# EAGLE board board (EAGLE 6.4)
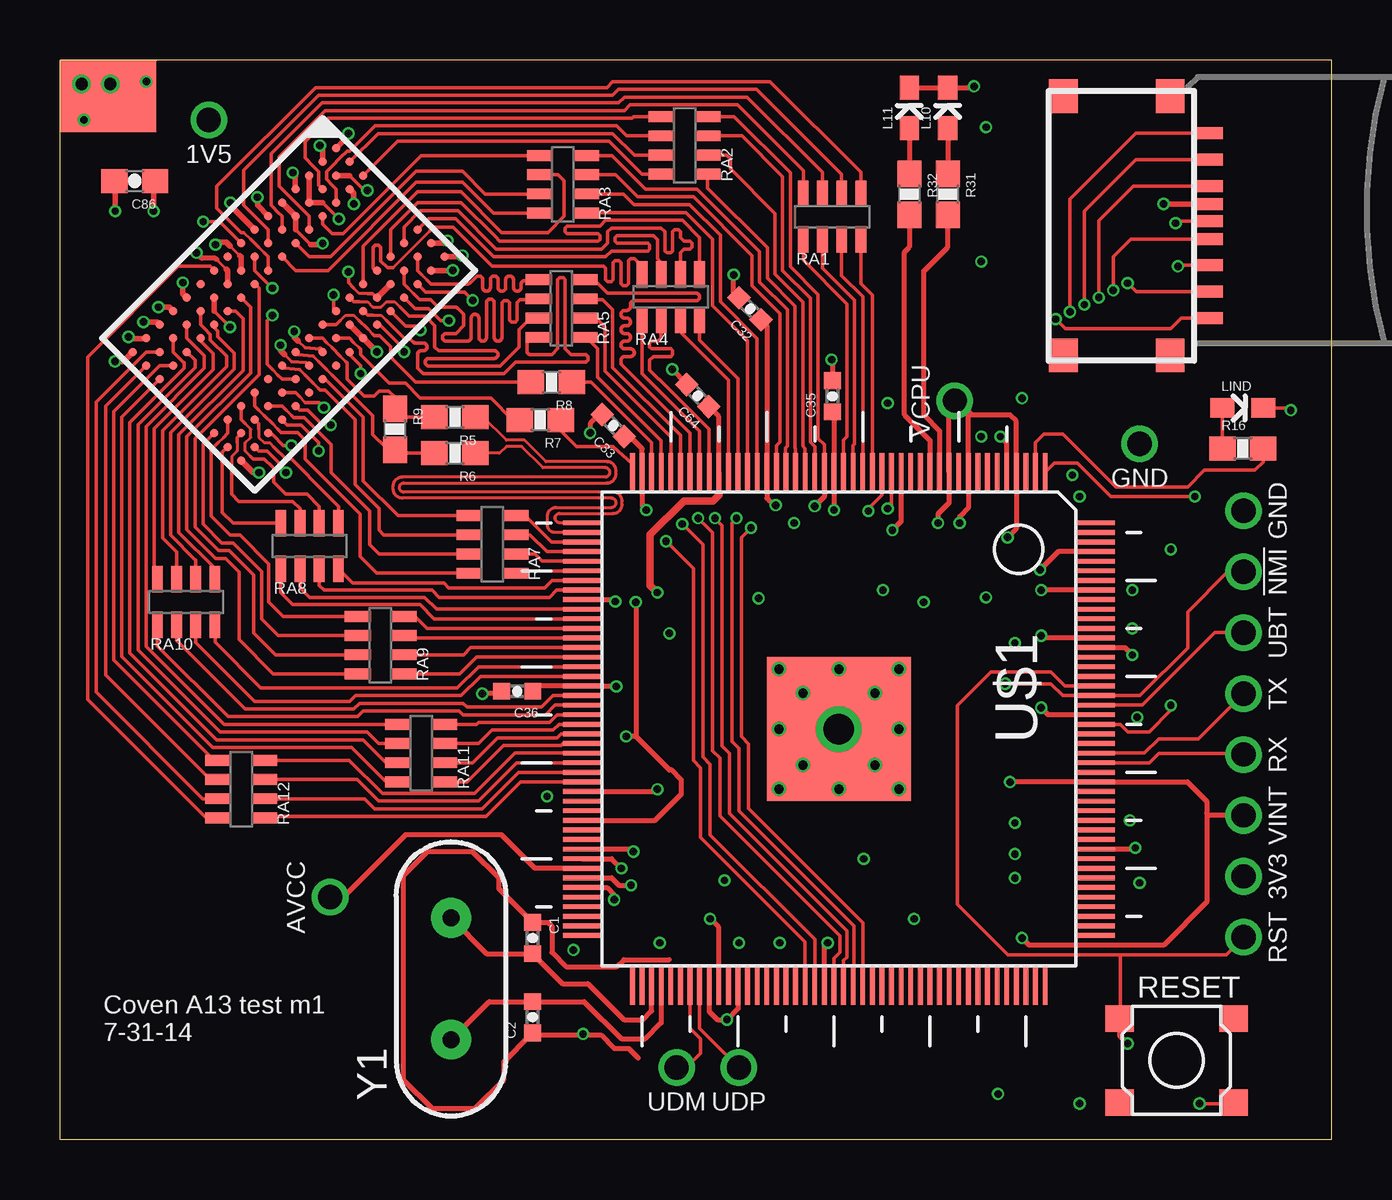
[diagram p2: board, top side]
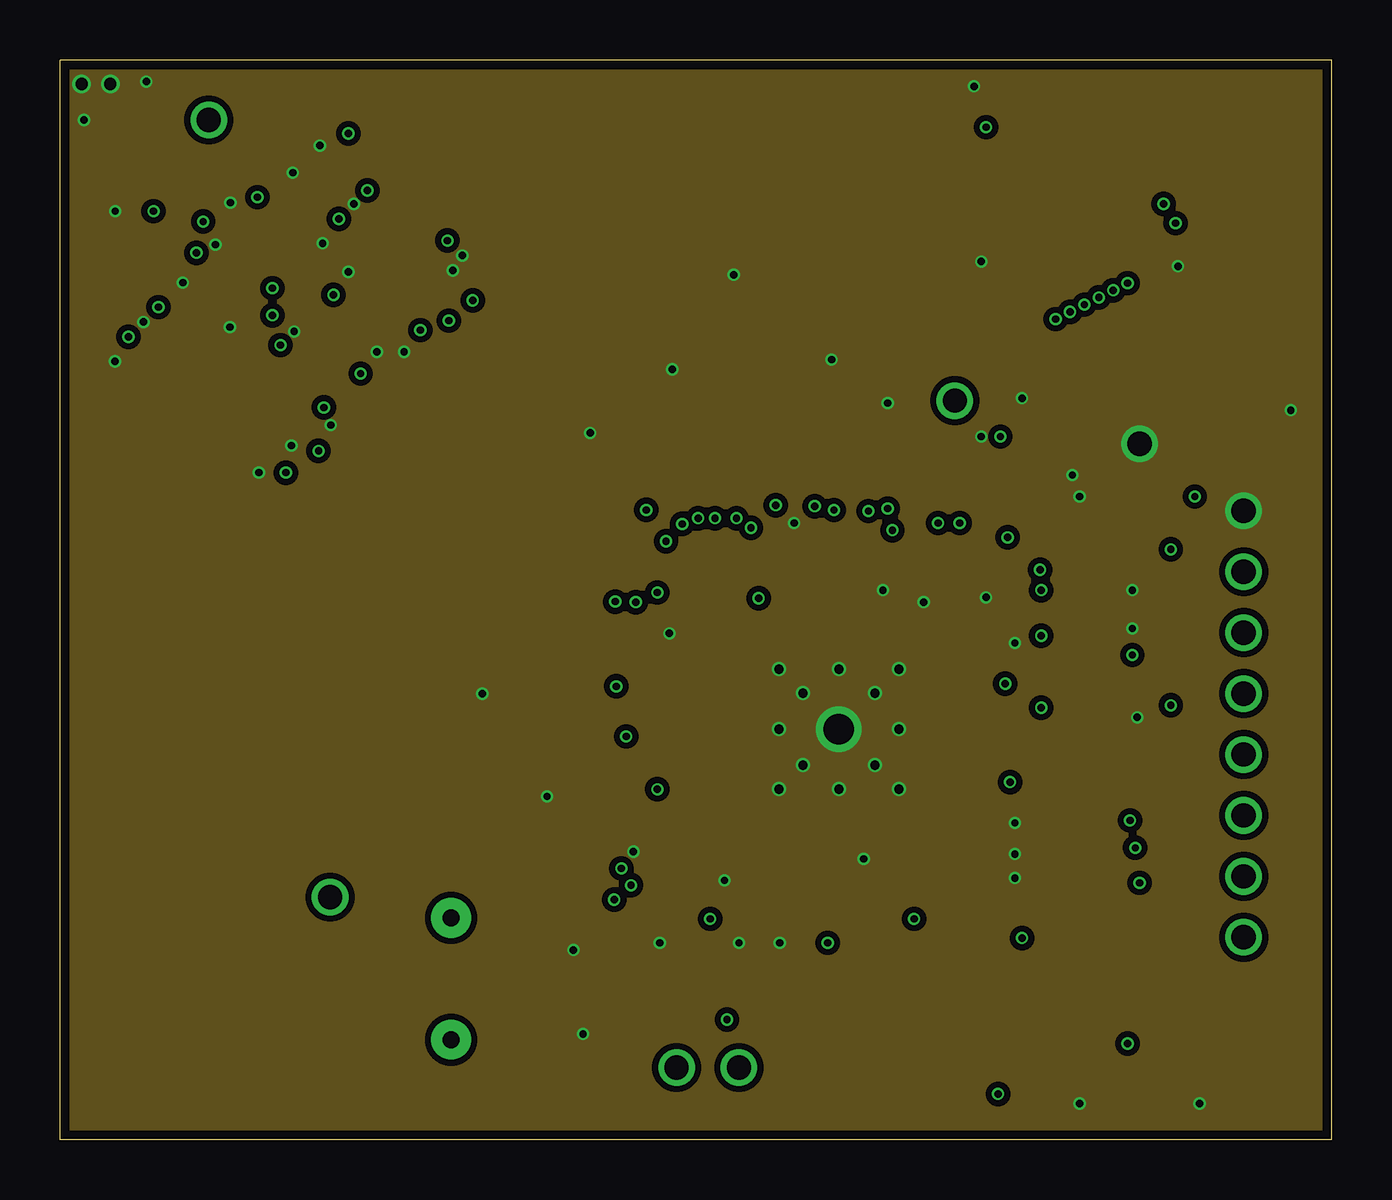
[diagram p3: board, inner layer Route2]
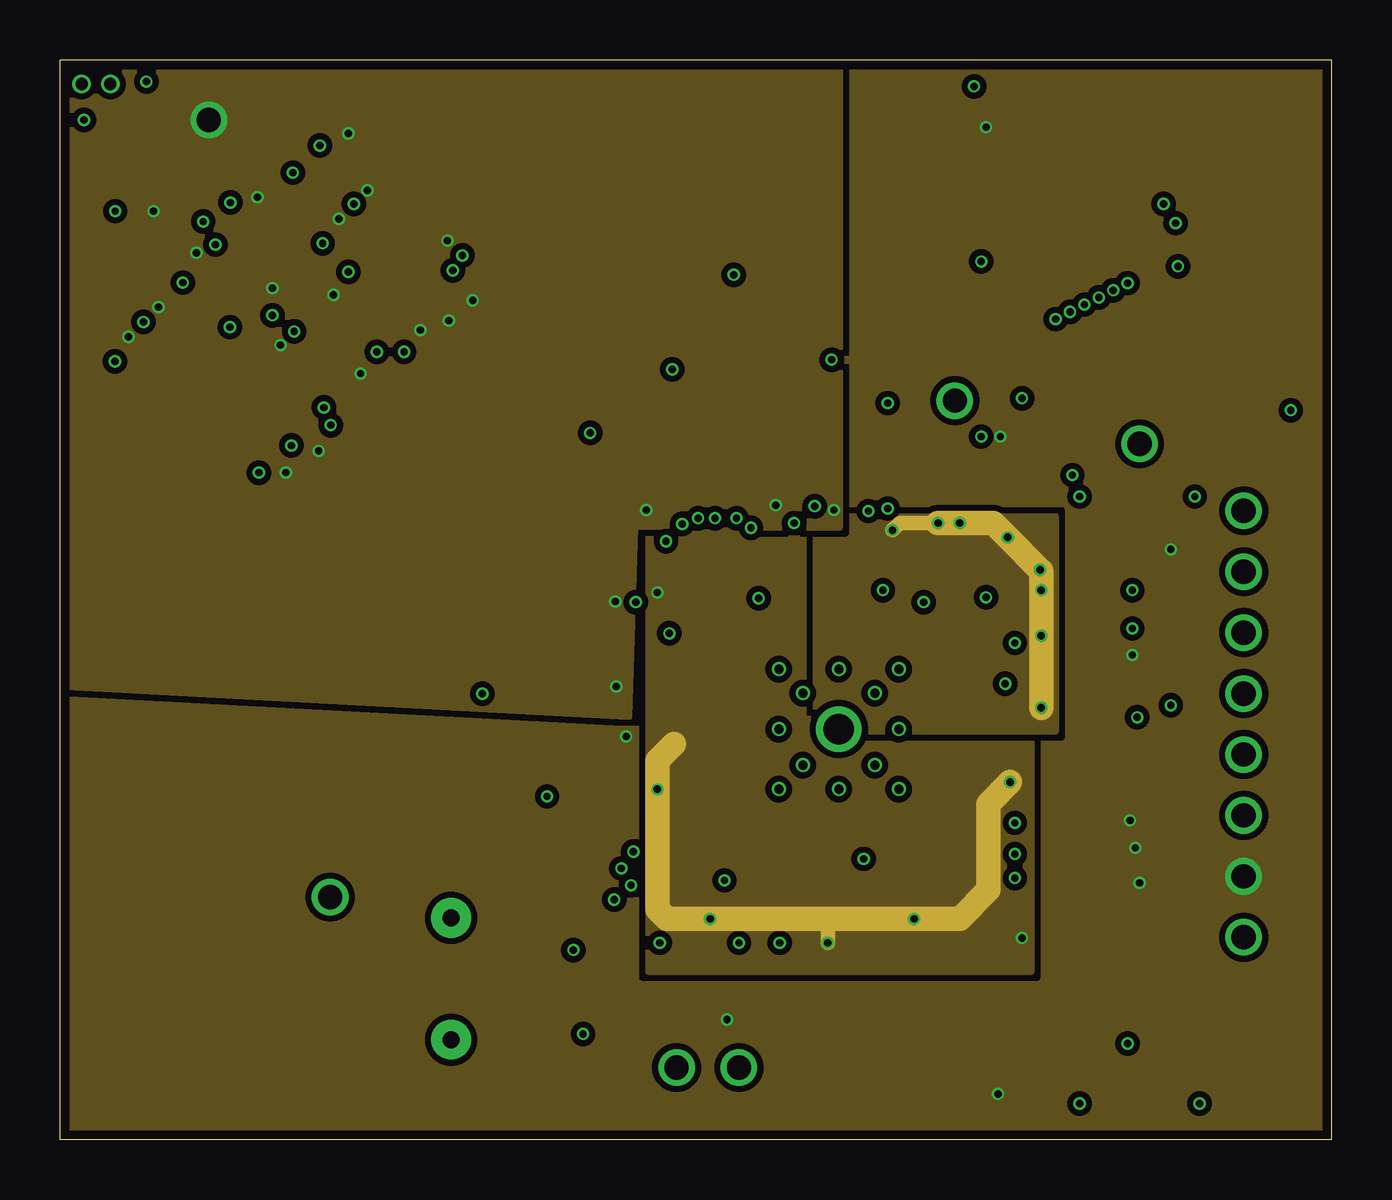
[diagram p4: board, inner layer Route15]
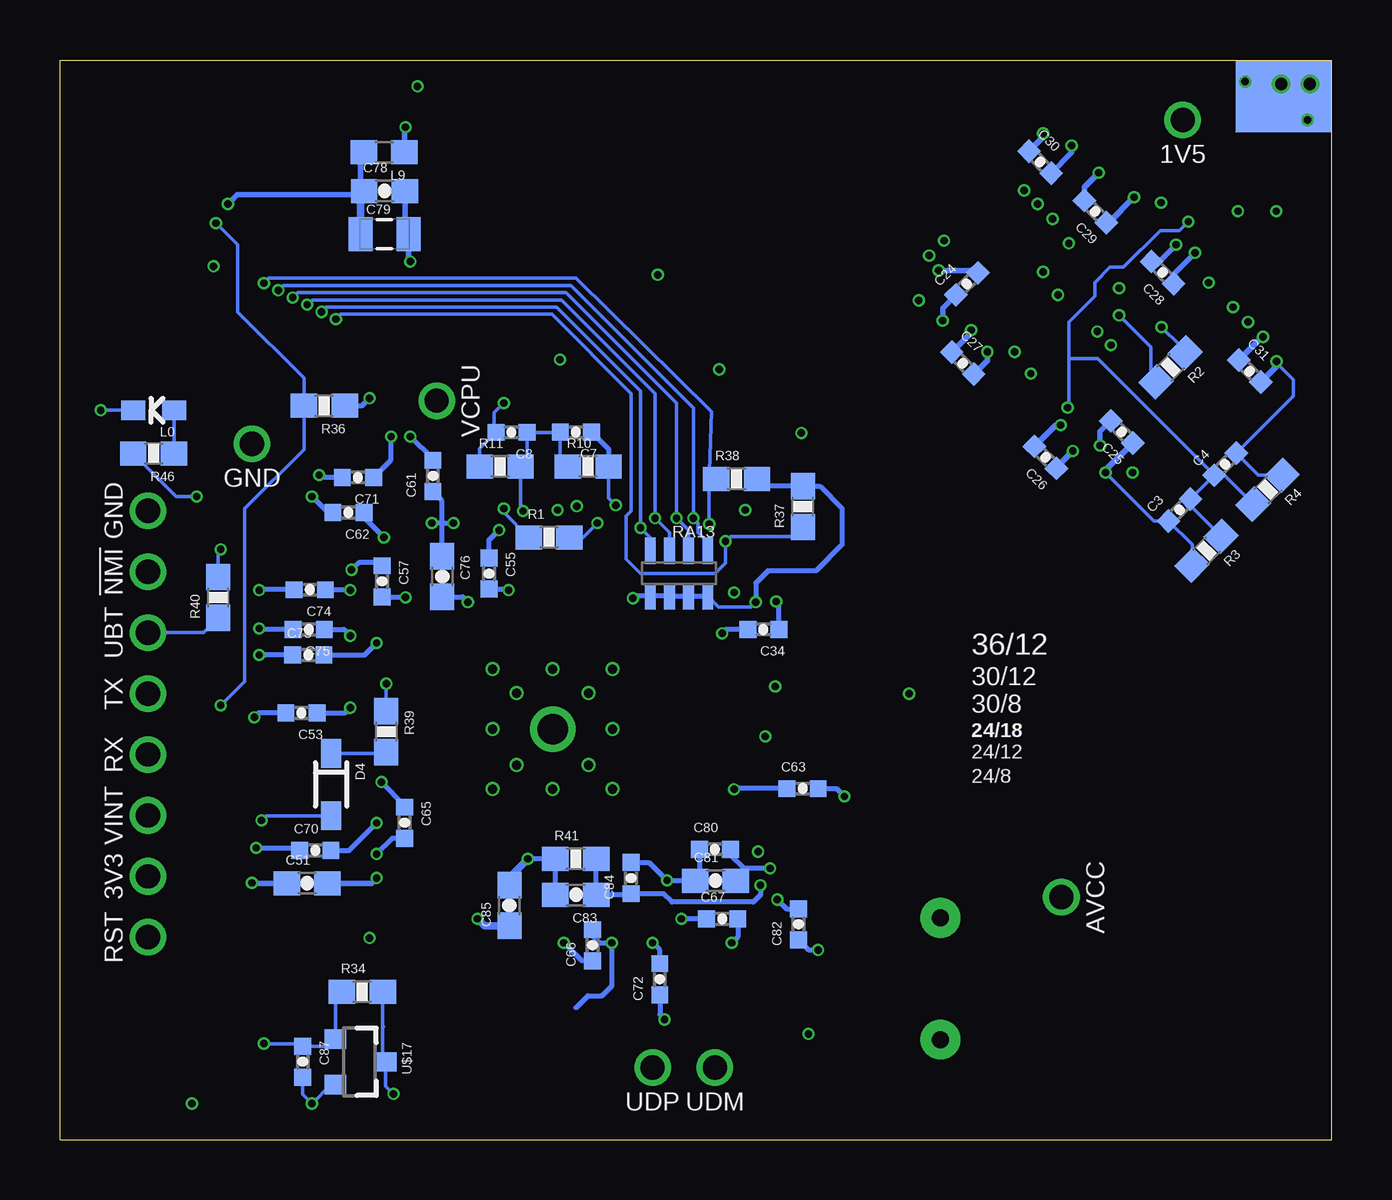
[diagram p5: board, bottom side, seen from below]

Size 53 x 45 mm. Coordinates in mm from the lower left corner, seen from the top.
Outline: 53,45 0,45 0,0 53,0 53,45
Copper layers (1+2*15+16): Top 0.0356mm / dielectric 0.17mm / Route2 0.0178mm / dielectric 1.1941mm / Route15 0.0178mm / dielectric 0.17mm / Bottom 0.0356mm
Design rules "OSHPark_mine_4layer": minimum track width 5mil, minimum drill 10mil, track to track 5mil, track to pad 5mil, pad to pad 5mil, via to via 5mil, smd to smd 5mil, copper to edge 15mil, drill to drill 6mil, minimum pad ring 4mil, minimum via ring 4mil, stop-mask expansion 2mil, vias tented up to drill 13mil, thermal gap 10mil

## Footprints (pad centres in the part's own frame; a part is rotated, then mirrored left to right if it is on the bottom)
0402-CAP = smd 0.7 x 0.7: 1 -0.65,0; 2 0.65,0
0603-CAP = smd 1.1 x 1: 1 -0.85,0; 2 0.85,0
0805-CAP = smd 1 x 1.4: 1 -1,0; 2 1,0
HOLE_22AWG = drill 1.016: P 0,0
CLIP-AREA = smd 4 x 3: P$1 0,0 | smd 4 x 3 bottom: P$2 0,0
SOD-323 = smd 1.2 x 0.83: A 1.3,0; C -1.3,0
BGA96 = smd 0.35 x 0.35: A1 -3.2,6; A2 -2.4,6; A3 -1.6,6; A7 1.6,6; A8 2.4,6; A9 3.2,6; B1 -3.2,5.2; B2 -2.4,5.2; B3 -1.6,5.2; B7 1.6,5.2; B8 2.4,5.2; B9 3.2,5.2; C1 -3.2,4.4; C2 -2.4,4.4; C3 -1.6,4.4; C7 1.6,4.4; C8 2.4,4.4; C9 3.2,4.4; D1 -3.2,3.6; D2 -2.4,3.6; D3 -1.6,3.6; D7 1.6,3.6; D8 2.4,3.6; D9 3.2,3.6; E1 -3.2,2.8; E2 -2.4,2.8; E3 -1.6,2.8; E7 1.6,2.8; E8 2.4,2.8; E9 3.2,2.8; F1 -3.2,2; F2 -2.4,2; F3 -1.6,2; F7 1.6,2; F8 2.4,2; F9 3.2,2; G1 -3.2,1.2; G2 -2.4,1.2; G3 -1.6,1.2; G7 1.6,1.2; G8 2.4,1.2; G9 3.2,1.2; H1 -3.2,0.4; H2 -2.4,0.4; H3 -1.6,0.4; H7 1.6,0.4; H8 2.4,0.4; H9 3.2,0.4; J1 -3.2,-0.4; J2 -2.4,-0.4; J3 -1.6,-0.4; J7 1.6,-0.4; J8 2.4,-0.4; J9 3.2,-0.4; K1 -3.2,-1.2; K2 -2.4,-1.2; K3 -1.6,-1.2; K7 1.6,-1.2; K8 2.4,-1.2; K9 3.2,-1.2; L1 -3.2,-2; L2 -2.4,-2; L3 -1.6,-2; L7 1.6,-2; L8 2.4,-2; L9 3.2,-2; M1 -3.2,-2.8; M2 -2.4,-2.8; M3 -1.6,-2.8; M7 1.6,-2.8; M8 2.4,-2.8; M9 3.2,-2.8; N1 -3.2,-3.6; N2 -2.4,-3.6; N3 -1.6,-3.6; N7 1.6,-3.6; N8 2.4,-3.6; N9 3.2,-3.6; P1 -3.2,-4.4; P2 -2.4,-4.4; P3 -1.6,-4.4; P7 1.6,-4.4; P8 2.4,-4.4; P9 3.2,-4.4; R1 -3.2,-5.2; R2 -2.4,-5.2; R3 -1.6,-5.2; R7 1.6,-5.2; R8 2.4,-5.2; R9 3.2,-5.2; T1 -3.2,-6; T2 -2.4,-6; T3 -1.6,-6; T7 1.6,-6; T8 2.4,-6; T9 3.2,-6
0603_LED = smd 0.8 x 1.003: A 0,-0.852; C 0,0.852
0603 = smd 1.1 x 1: 1 -0.85,0; 2 0.85,0
0603-RES = smd 1.1 x 1: 1 -0.85,0; 2 0.85,0
0603-ARV = smd 0.45 x 1.1: 1 -1.2,-0.95; 2 -0.4,-0.95; 3 0.4,-0.95; 4 1.2,-0.95; 5 1.2,0.95; 6 0.4,0.95; 7 -0.4,0.95; 8 -1.2,0.95
TAC_SWITCH_SMD_4.5X4.5 = smd 1.2 x 1.1: 1 -2.375,1.75; 2 2.375,1.75; 3 -2.375,-1.75; 4 2.375,-1.75
TQFP176_0.4 = smd 1.6 x 0.2: 001 -10.7,8.6; 002 -10.7,8.2; 003 -10.7,7.8; 004 -10.7,7.4; 005 -10.7,7; 006 -10.7,6.6; 007 -10.7,6.2; 008 -10.7,5.8; 009 -10.7,5.4; 010 -10.7,5; 011 -10.7,4.6; 012 -10.7,4.2; 013 -10.7,3.8; 014 -10.7,3.4; 015 -10.7,3; 016 -10.7,2.6; 017 -10.7,2.2; 018 -10.7,1.8; 019 -10.7,1.4; 020 -10.7,1; 021 -10.7,0.6; 022 -10.7,0.2; 023 -10.7,-0.2; 024 -10.7,-0.6; 025 -10.7,-1; 026 -10.7,-1.4; 027 -10.7,-1.8; 028 -10.7,-2.2; 029 -10.7,-2.6; 030 -10.7,-3; 031 -10.7,-3.4; 032 -10.7,-3.8; 033 -10.7,-4.2; 034 -10.7,-4.6; 035 -10.7,-5; 036 -10.7,-5.4; 037 -10.7,-5.8; 038 -10.7,-6.2; 039 -10.7,-6.6; 040 -10.7,-7; 041 -10.7,-7.4; 042 -10.7,-7.8; 043 -10.7,-8.2; 044 -10.7,-8.6; 089 10.7,-8.6; 090 10.7,-8.2; 091 10.7,-7.8; 092 10.7,-7.4; 093 10.7,-7; 094 10.7,-6.6; 095 10.7,-6.2; 096 10.7,-5.8; 097 10.7,-5.4; 098 10.7,-5; 099 10.7,-4.6; 100 10.7,-4.2; 101 10.7,-3.8; 102 10.7,-3.4; 103 10.7,-3; 104 10.7,-2.6; 105 10.7,-2.2; 106 10.7,-1.8; 107 10.7,-1.4; 108 10.7,-1; 109 10.7,-0.6; 110 10.7,-0.2; 111 10.7,0.2; 112 10.7,0.6; 113 10.7,1; 114 10.7,1.4; 115 10.7,1.8; 116 10.7,2.2; 117 10.7,2.6; 118 10.7,3; 119 10.7,3.4; 120 10.7,3.8; 121 10.7,4.2; 122 10.7,4.6; 123 10.7,5; 124 10.7,5.4; 125 10.7,5.8; 126 10.7,6.2; 127 10.7,6.6; 128 10.7,7; 129 10.7,7.4; 130 10.7,7.8; 131 10.7,8.2; 132 10.7,8.6 | smd 0.2 x 1.6: 045 -8.6,-10.7; 046 -8.2,-10.7; 047 -7.8,-10.7; 048 -7.4,-10.7; 049 -7,-10.7; 050 -6.6,-10.7; 051 -6.2,-10.7; 052 -5.8,-10.7; 053 -5.4,-10.7; 054 -5,-10.7; 055 -4.6,-10.7; 056 -4.2,-10.7; 057 -3.8,-10.7; 058 -3.4,-10.7; 059 -3,-10.7; 060 -2.6,-10.7; 061 -2.2,-10.7; 062 -1.8,-10.7; 063 -1.4,-10.7; 064 -1,-10.7; 065 -0.6,-10.7; 066 -0.2,-10.7; 067 0.2,-10.7; 068 0.6,-10.7; 069 1,-10.7; 070 1.4,-10.7; 071 1.8,-10.7; 072 2.2,-10.7; 073 2.6,-10.7; 074 3,-10.7; 075 3.4,-10.7; 076 3.8,-10.7; 077 4.2,-10.7; 078 4.6,-10.7; 079 5,-10.7; 080 5.4,-10.7; 081 5.8,-10.7; 082 6.2,-10.7; 083 6.6,-10.7; 084 7,-10.7; 085 7.4,-10.7; 086 7.8,-10.7; 087 8.2,-10.7; 088 8.6,-10.7; 133 8.6,10.7; 134 8.2,10.7; 135 7.8,10.7; 136 7.4,10.7; 137 7,10.7; 138 6.6,10.7; 139 6.2,10.7; 140 5.8,10.7; 141 5.4,10.7; 142 5,10.7; 143 4.6,10.7; 144 4.2,10.7; 145 3.8,10.7; 146 3.4,10.7; 147 3,10.7; 148 2.6,10.7; 149 2.2,10.7; 150 1.8,10.7; 151 1.4,10.7; 152 1,10.7; 153 0.6,10.7; 154 0.2,10.7; 155 -0.2,10.7; 156 -0.6,10.7; 157 -1,10.7; 158 -1.4,10.7; 159 -1.8,10.7; 160 -2.2,10.7; 161 -2.6,10.7; 162 -3,10.7; 163 -3.4,10.7; 164 -3.8,10.7; 165 -4.2,10.7; 166 -4.6,10.7; 167 -5,10.7; 168 -5.4,10.7; 169 -5.8,10.7; 170 -6.2,10.7; 171 -6.6,10.7; 172 -7,10.7; 173 -7.4,10.7; 174 -7.8,10.7; 175 -8.2,10.7; 176 -8.6,10.7 | drill 1.27: P$1 0,0 | drill 0.381: P$2 -2.5,2.5; P$3 0,2.5; P$4 2.5,2.5; P$5 2.5,-2.5; P$6 1.5,-1.5; P$7 0,-2.5; P$8 -1.5,-1.5; P$9 -1.5,1.5; P$10 1.5,1.5; P$11 2.5,0; P$12 -2.5,-2.5; P$13 -2.5,0 | smd 6 x 6: PAD 0,0
MICROSD-MOLEX-1050270001 = smd 0.5 x 1.2: G1 0.2,-6.65; P1 3.85,-6.65; P2 2.75,-6.65; P3 1.65,-6.65; P4 0.9,-6.65; P5 -0.55,-6.65; P6 -1.65,-6.65; P7 -2.75,-6.65; P8 -3.85,-6.65 | smd 1.4 x 1.2: SHELL1 -5.4,-0.6; SHELL2 5.4,-0.6; SHELL3 5.4,-5.05; SHELL4 -5.4,-5.05
SOT23-3 = smd 0.8 x 0.9: 1 -0.95,-1; 2 0.95,-1; 3 0,1.1
HC49US = drill 0.7 pad 1.651: 1 -2.54,0; 2 2.54,0

## Placement (x,y rotation side)
C1  22pF  [0402-CAP]  19.7,8.4 270 top
C2  22pF  [0402-CAP]  19.7,5.1 90 top
C3  0.1uF  [0402-CAP]  6.34,26.24 45 bottom
C4  0.1uF  [0402-CAP]  4.43,28.15 45 bottom
C7  0.1uF  [0402-CAP]  31.49,29.48 180 bottom
C8  0.1uF  [0402-CAP]  34.18,29.48 180 bottom
C24  0.1uF  [0402-CAP]  15.2,35.67 45 bottom
C25  1uF  [0402-CAP]  8.74,29.5 135 bottom
C26  0.1uF  [0402-CAP]  11.92,28.43 135 bottom
C27  0.1uF  [0402-CAP]  15.37,32.36 315 bottom
C28  0.1uF  [0402-CAP]  7.04,36.14 135 bottom
C29  0.1uF  [0402-CAP]  9.85,38.68 135 bottom
C30  0.1uF  [0402-CAP]  12.15,40.74 315 bottom
C31  1uF  [0402-CAP]  3.41,32.03 315 bottom
C32  0.1uF  [0402-CAP]  28.76,34.63 135 top
C33  0.1uF  [0402-CAP]  23.06,29.76 135 top
C34  0.1uF  [0402-CAP]  23.68,21.27 180 bottom
C35  0.1uF  [0402-CAP]  32.2,30.99 90 top
C36  0.1uF  [0402-CAP]  19.06,18.69 180 top
C51  4.7uF  [0603-CAP]  42.7,10.68 0 bottom
C53  0.1uF  [0402-CAP]  42.93,17.79 180 bottom
C55  0.1uF  [0402-CAP]  35.12,23.59 270 bottom
C57  0.1uF  [0402-CAP]  39.57,23.26 270 bottom
C61  0.1uF  [0402-CAP]  37.46,27.66 90 bottom
C62  0.1uF  [0402-CAP]  40.98,26.13 180 bottom
C63  0.1uF  [0402-CAP]  22.05,14.63 0 bottom
C64  0.1uF  [0402-CAP]  26.58,31.01 135 top
C65  0.1uF  [0402-CAP]  38.63,13.21 270 bottom
C66  0.1uF  [0402-CAP]  30.8,8.1 90 bottom
C67  0.1uF  [0402-CAP]  25.4,9.2 0 bottom
C70  0.1uF  [0402-CAP]  42.36,12.05 0 bottom
C71  0.1uF  [0402-CAP]  40.58,27.6 180 bottom
C72  0.1uF  [0402-CAP]  28,6.68 90 bottom
C73  0.1uF  [0402-CAP]  42.65,20.2 0 bottom
C74  0.1uF  [0402-CAP]  42.59,22.92 180 bottom
C75  0.1uF  [0402-CAP]  42.63,21.26 180 bottom
C76  4.7uF  [0603-CAP]  37.07,23.47 270 bottom
C78  10uF  [0603-CAP]  39.47,39.54 0 bottom
C79  22uF  [0805-CAP]  39.47,37.74 0 bottom
C80  0.1uF  [0402-CAP]  25.7,12.1 0 bottom
C81  10uF  [0603-CAP]  25.68,10.79 0 bottom
C82  1uF  [0402-CAP]  22.22,8.97 90 bottom
C83  10uF  [0603-CAP]  31.5,10.2 180 bottom
C84  0.1uF  [0402-CAP]  29.2,10.9 90 bottom
C85  4.7uF  [0603-CAP]  34.27,9.76 90 bottom
C86  4.7uF  [0603-CAP]  3.12,39.95 180 top
C87  0.1uF  [0402-CAP]  42.88,3.24 270 bottom
CONN1  3V3  [HOLE_22AWG]  49.34,10.97 90 top
CONN2  VCPU  [HOLE_22AWG]  37.3,30.8 270 top
CONN3  VINT  [HOLE_22AWG]  49.34,13.51 90 top
CONN4  1V5  [HOLE_22AWG]  6.2,42.5 0 top
CONN5  GND  [HOLE_22AWG]  49.34,26.21 90 top
CONN6  UDM  [HOLE_22AWG]  25.7,3 0 top
CONN7  AVCC  [HOLE_22AWG]  11.26,10.1 270 top
CONN8  gnd  [CLIP-AREA]  2,43.5 0 top
CONN9  UDP  [HOLE_22AWG]  28.3,3 0 top
CONN10  TX  [HOLE_22AWG]  49.34,18.59 90 top
CONN11  UBT  [HOLE_22AWG]  49.34,21.13 90 top
CONN12  GND  [HOLE_22AWG]  45,29 0 top
CONN14  !NMI  [HOLE_22AWG]  49.34,23.67 90 top
CONN17  RST  [HOLE_22AWG]  49.34,8.43 90 top
CONN18  RX  [HOLE_22AWG]  49.34,16.05 90 top
D4  B5819WS  [SOD-323]  41.7,14.8 270 bottom
DDR3_1  x16, 96FBGA: AS4C{64/128/256}M16D3  [BGA96]  9.53,34.81 315 top
L0  WHT  [0603_LED]  49.1,30.4 90 bottom
L9  CIC10J601(750mA,600R)  [0603]  39.49,41.16 180 bottom
L10  GRN  [0603_LED]  37,43 0 top
L11  YLW  [0603_LED]  35.4,43 0 top
LIND  BLU  [0603_LED]  49.3,30.5 270 top
R1  240R 1%  [0603-RES]  32.62,25.1 0 bottom
R2  240R 1%  [0603-RES]  6.71,32.19 225 bottom
R3  1k 1%  [0603-RES]  5.21,24.55 225 bottom
R4  1k 1%  [0603-RES]  2.66,27.09 225 bottom
R5  22R  [0603-RES]  16.46,30.11 180 top
R6  22R  [0603-RES]  16.46,28.61 180 top
R7  22R  [0603-RES]  20.02,30 180 top
R8  22R  [0603-RES]  20.48,31.57 180 top
R9  100R  [0603-RES]  13.96,29.61 270 top
R10  1k 1%  [0603-RES]  30.98,28.06 0 bottom
R11  1k 1%  [0603-RES]  34.65,28.05 0 bottom
R16  1k  [0603-RES]  49.3,28.8 0 top
R31  470R  [0603-RES]  37,39.4 270 top
R32  470R  [0603-RES]  35.4,39.4 270 top
R34  10k  [0603-RES]  40.4,6.16 0 bottom
R36  10k  [0603-RES]  41.98,30.59 180 bottom
R37  47k  [0603-RES]  22.04,26.38 90 bottom
R38  47k  [0603-RES]  24.8,27.54 0 bottom
R39  47k  [0603-RES]  39.4,17 270 bottom
R40  100k  [0603-RES]  46.4,22.6 90 bottom
R41  200k 1%  [0603-RES]  31.5,11.7 0 bottom
R46  1k  [0603-RES]  49.1,28.6 180 bottom
RA1  22R  [0603-ARV]  32.18,38.47 0 top
RA2  22R  [0603-ARV]  26.04,41.43 90 top
RA3  22R  [0603-ARV]  20.96,39.81 90 top
RA4  22R  [0603-ARV]  25.46,35.12 0 top
RA5  22R  [0603-ARV]  20.9,34.64 90 top
RA7  22R  [0603-ARV]  18.02,24.81 90 top
RA8  22R  [0603-ARV]  10.41,24.74 0 top
RA9  22R  [0603-ARV]  13.36,20.61 90 top
RA10  22R  [0603-ARV]  5.26,22.41 0 top
RA11  22R  [0603-ARV]  15.06,16.11 90 top
RA12  22R  [0603-ARV]  7.56,14.61 90 top
RA13  47k  [0603-ARV]  27.2,23.6 180 bottom
S_RESET  TAC_SWITCHSMD_4.5X4.5  [TAC_SWITCH_SMD_4.5X4.5]  46.54,3.3 180 top
U$1  A13  [TQFP176_0.4]  32.46,17.11 270 top
U$15  Molex 1050270001  [MICROSD-MOLEX-1050270001]  41.22,38.09 90 top
U$17  RT9818C-29GV  [SOT23-3]  40.52,3.24 270 bottom
Y1  24MHz  [HC49US]  16.3,6.7 90 top

## Tracks (layer width: path | path; a pad name or v marks a point on that pad's centre or on a via)
1.5V  (via drill 0.3)
  Top 0.127: 6.93,36.28 6.54,36.68 | 9.36,32.72 9.65,32.44
  Top 0.14: 8.29,36.06 8.52,35.83 | 11.12,38.89 11.34,38.66 | 12.25,40.02 12.47,39.79
  Top 0.152: C35.1 32.26,30.28 | 32.26,30.28 | 9.42,27.91 8.63,28.7 8.29,28.7 DDR3_1.R9 | v10.78,28.7 10.78,29.04 10.04,29.78 9.48,29.78 DDR3_1.N9 | 10.27,32.38 9.65,32.44 | v12.53,31.93 12.53,32.27 12.08,32.72 DDR3_1.H9 | v11.4,35.21 11.4,34.64 DDR3_1.G7 | v15.02,33.74 14.85,33.91 14.4,33.91 DDR3_1.E9 | 16.04,37.36 v16.15,37.47 | v16.21,34.13 15.87,34.13 15.36,34.64 14.79,34.64 DDR3_1.D9 | v17.2,34.98 16.86,35.32 15.25,35.32 DDR3_1.C9 | 8.29,36.06 8.12,36.23 DDR3_1.H2 | v8.85,35.49 8.52,35.83 | v11.63,38.38 11.34,38.66 | 10.95,39.05 11.12,38.89 | 12.08,40.19 12.25,40.02 | 12.7,39.56 12.47,39.79 | 10.27,32.38 | 10.27,32.38 DDR3_1.K8
  Top 0.203: v5.69,36.96 5.91,36.74 6.48,36.74 6.54,36.68 | 23.17,18.91 v23.19,18.89 23.17,18.91 | v23.15,22.42 23.07,22.51 U$1.053 | v24.44,26.24 24.26,26.42 U$1.043 24.26,28.8 23.76,29.3 C33.1 | 32.26,30.28 U$1.023 | U$1.023 | C32.1 29.46,33.93 U$1.030 29.46,26.74 29.6,26.6 | C36.1 19.93,18.91 U$1.062 23.17,18.91 | U$1.023 v32.26,26.24
  Top 0.229: 9.42,27.91 v9.42,27.8 | v4.1,34.7 4.55,34.7 DDR3_1.N1 | v9.19,33.12 9.19,32.89 9.36,32.72 | v8.23,39.28 8.23,38.94 DDR3_1.F1 | 12.7,39.56 v12.81,39.56 | DDR3_1.A1 12.02,41.83 v12.02,41.94 | 10.95,39.05 DDR3_1.D2 DDR3_1.C1 | 6.99,36.23 6.93,36.28 | DDR3_1.A8 16.04,37.36 | C86.1 3.9,39.88 v3.9,38.7 | DDR3_1.B2 12.08,40.19 | DDR3_1.R1 3.57,33.38 2.98,33.38 2.9,33.45 v2.86,33.45 | 6.99,36.23 | 6.99,36.23 DDR3_1.K2
  Bottom 0.152: 5.81,24.79 C3.1 7.41,25.78 v9.42,27.8 | 5.81,24.79 | 5.81,24.79 R3.2 | R10.2 30.14,26.75 v29.83,26.44
  Bottom 0.203: C28.1 6.58,36.07 v5.69,36.96 | C7.1 30.14,28.78 R10.2 | C34.1 23.03,22.3 v23.15,22.42
  Bottom 0.229: C26.1 11.46,28.02 v10.78,28.7 | C25.1 9.42,27.9 v9.42,27.8 | C27.1 15.02,33.63 v15.02,33.74 | C24.1 16.21,34.66 v16.21,34.13 | C30.1 12.02,41.79 v12.02,41.94 | C31.1 2.9,33.45 v2.86,33.45 | v8.23,39.28 9.29,38.22 C29.1
  pour Route15 (isolate 0.254, no thermals): -2.5,46 32.5,46 32.5,25.5 26.3,25.5 23.96,25.54 23.73,17.59 -2.5,19
3.3V  (via drill 0.3)
  Top 0.203: U$1.142 44.77,12.11 v44.82,12.16 | U$1.076 24.81,13.31 25.9,14.4 25.9,15 25.5,15.4 25.4,15.4 24,16.8 | U$1.163 44.39,20.51 v44.7,20.2 | U$1.005 39.46,29.04 v39.2,29.3 | U$1.100 28.26,5.46 v27.8,5 27.4,5 27.06,5.34 U$1.097 | v24,22.4 24,16.8 | 24,16.8 v23.6,16.8
  Bottom 0.152: R34.2 39.55,4.66 | 39.55,4.66 39.55,3.37 U$17.3 39.42,2.22 v39.1,1.9 | 39.55,4.66 39.51,4.7 | D4.A 44.4,13.5 v44.6,13.3 | RA13.8 25.55,22.2 24.2,22.2 v24,22.4 | R40.2 46.4,24.5 v46.3,24.6
  Bottom 0.203: v44.82,12.16 43.12,12.16 C70.1 | C73.1 v44.7,20.2 | C71.1 39.2,28.33 v39.2,29.3 | C72.1 28,5.2 v27.8,5 | v29.12,22.56 29.03,22.65 RA13.5 RA13.6 RA13.7 RA13.8 | R38.2 23.64,27.23 R37.2 21.33,27.23 20.4,26.3 20.4,24.8 21.5,23.7 23.5,23.7 24,23.2 v24,22.4
  Bottom 0.229: C51.1 44.98,10.68 v45,10.7 | L9.1 38.64,42.16 v38.6,42.2
  pour Route15 (isolate 0.254, rank 5, no thermals): -5,50 60,50 60,-5 -5,-5
AVCC
  Top 0.203: U$1.081 19.79,11.31 18.4,12.7 14.4,12.7 11.8,10.1 CONN7.P
DDR3_A0
  Top 0.14: 3.93,29.64 6.38,32.08
  Top 0.152: 6.38,32.08 6.38,32.76 5.86,33.28 DDR3_1.N3 | RA10.8 3.93,23.48 3.93,29.64
DDR3_A1
  Top 0.127: 7.95,28.48 7.72,28.7 7.72,29.04 7.95,29.27 7.95,29.61 7.72,29.84
  Top 0.152: 7.72,29.84 7.55,30 DDR3_1.P7 | 7.95,28.48 8.06,28.36 8.52,28.36 8.85,28.02 8.9,27.98 8.9,27.4 9.4,26.9 10.3,26.9 10.81,26.39 RA8.6
DDR3_A2
  Top 0.14: 3.25,29.81 5.63,32.18
  Top 0.152: RA11.6 13.28,16.51 12.8,16.99 6.68,16.99 3.56,20.11 | 5.63,32.18 5.63,32.49 | DDR3_1.P3 5.63,32.49 | 5.63,32.49 | 3.56,20.11 | 3.25,29.81 3.25,20.41 3.56,20.11
DDR3_A3
  Top 0.14: 3.59,29.72 6.02,32.15 | 5.46,33.23 5.69,33
  Top 0.152: RA11.5 6.84,17.31 3.88,20.27 3.59,20.55 3.59,29.72 | 6.02,32.15 6.02,32.67 5.69,33 | 5.46,33.23 5.29,33.4 DDR3_1.N2
DDR3_A4
  Top 0.127: 8.29,29.61 8.29,29.27 8.52,29.04 8.74,29.04 8.91,28.87
  Top 0.152: 8.29,29.84 8.29,29.61 | 8.91,28.87 9.42,28.36 9.65,28.36 11.1,26.91 11.1,26.9 11.61,26.39 RA8.5 | 8.29,29.84 | 8.29,29.84 DDR3_1.P8
DDR3_A5
  Top 0.14: 2.92,29.89 5.12,32.1 | 5.12,32.44 4.89,32.66
  Top 0.152: 13.6,15.71 12.64,16.67 6.52,16.67 2.92,20.27 2.92,29.89 | 4.89,32.66 4.72,32.83 DDR3_1.P2 | 5.12,32.44 5.17,32.39 5.17,32.15 5.12,32.1 | 13.6,15.71 | 13.6,15.71 RA11.7
DDR3_A6
  Top 0.127: 7.38,29.04 7.38,28.7 7.16,28.48 7.16,28.14
  Top 0.152: DDR3_1.R8 7.38,29.27 7.38,29.04 | 7.16,28.14 7.16,26.9 7.46,26.6 9.7,26.6 10.01,26.29 RA8.7
DDR3_A7
  Top 0.14: 3.2,32.44 3.42,32.66
  Top 0.152: RA12.7 5.94,14.21 1.5,18.65 1.5,30.74 3.2,32.44 | 3.42,32.66 3.59,32.83 DDR3_1.R2
DDR3_A8
  Top 0.152: DDR3_1.T8 6.76,28.65 6.76,26.14 7.21,25.69 RA8.8
DDR3_A9
  Top 0.14: 3.99,32.1 3.76,31.87
  Top 0.152: 3.99,32.1 4.16,32.27 DDR3_1.R3 | 3.76,31.87 2.24,30.34 2.24,19.99 6.42,15.81 RA12.5 | RA12.5
DDR3_A10
  Top 0.127: 10.78,31.31 10.55,31.53 | 10.21,31.87 9.99,32.1
  Top 0.152: 9.99,32.1 9.36,32.15 DDR3_1.L7 | 10.78,31.31 10.83,31.25 11.06,31.25 12.3,30 12.3,27.3 13.3,26.3 13.3,25.4 13.49,25.21 RA7.6 | 10.55,31.53 10.21,31.87
DDR3_A11
  Top 0.127: 6.59,29.04 6.82,29.27
  Top 0.152: 6.99,29.44 6.82,29.27 | 6.59,29.04 6.31,28.76 6.31,25.99 7.1,25.2 7.5,25.2 8.7,24 8.7,22.4 9.29,21.81 RA9.5 | DDR3_1.R7 6.99,29.44 | 6.99,29.44
DDR3_A12
  Top 0.127: 8.29,30.4 8.52,30.17 | 9.08,29.61 8.85,29.84
  Top 0.152: 9.08,29.61 9.22,29.47 9.9,29.47 10.21,29.16 10.21,28.36 12.5,26.08 12.5,24.3 13.19,23.61 RA7.8 | 8.12,30.57 8.29,30.4 | 8.52,30.17 8.85,29.84 | DDR3_1.N7 8.12,30.57 | 8.12,30.57
DDR3_A13
  Top 0.152: DDR3_1.T3 2.58,30.12 2.58,20.13 2.92,19.79 6.36,16.35 12.16,16.35 13.6,14.91 RA11.8 | RA11.8
DDR3_A14
  Top 0.152: 8.4,23.69 7.22,24.87 6.88,24.87 | 6.88,24.87 6.75,24.87 5.97,25.65 5.97,28.99 DDR3_1.T7 | 8.4,23.69 | 6.88,24.87 | RA9.6 9.09,21.01 8.4,21.7 8.4,23.69
DDR3_BA0
  Top 0.14: 4.27,29.55 6.94,32.22 | 6.03,33.8 6.27,33.55
  Top 0.152: RA10.7 4.86,24.49 4.27,25.08 4.27,29.55 | 6.94,32.22 6.94,32.66 6.27,33.33 6.27,33.55 | 6.03,33.8 5.86,33.96 DDR3_1.M2
DDR3_BA1
  Top 0.127: 9.42,30.4 9.65,30.17
  Top 0.152: 9.65,30.17 9.73,30.09 10.18,30.09 11.3,28.97 11.3,27.8 12.9,26.2 12.9,24.8 13.29,24.41 RA7.7 | 9.25,30.57 9.42,30.4 | DDR3_1.N8 9.25,30.57 | 9.25,30.57
DDR3_BA2
  Top 0.14: 4.61,29.47 7.26,32.12
  Top 0.152: RA10.6 5.66,24.17 5.64,24.17 4.61,25.19 4.61,29.47 | 7.26,32.12 7.26,32.78 6.58,33.47 6.58,33.7 6.42,33.85 | 6.42,33.85 | 6.42,33.85 DDR3_1.M3
DDR3_CAS
  Top 0.14: 5.29,29.3 7.95,31.96
  Top 0.152: 6.9,24.23 7.46,23.67 7.46,20.84 8.89,19.41 RA9.8 | 7.95,31.96 7.95,34.7 | DDR3_1.K3 7.95,34.7 | 7.95,34.7 | 6.9,24.23 6.48,24.23 5.29,25.42 5.29,29.3 | 6.9,24.23
DDR3_CK
  Top 0.127: 11.91,32.44 11.68,32.66 | 11.12,33.23 11.34,33
  Top 0.152: R5.2 14.31,30.11 R9.1 | 10.95,33.4 11.12,33.23 | R9.1 13.89,30.46 | 11.34,33 11.68,32.66 | 11.91,32.44 11.97,32.38 11.97,31.7 12.67,31 13.1,31 13.3,31.2 13.7,31.2 13.96,30.94 R9.1 | DDR3_1.J7 10.95,33.4 | 10.95,33.4
DDR3_CK#
  Top 0.127: 11.12,32.1 11.34,31.87 | 10.78,32.44 10.55,32.66
  Top 0.152: R6.2 14.11,28.61 R9.2 13.9,28.82 13.61,28.82 | 13.67,28.76 13.61,28.82 | 13.61,28.82 13.04,29.39 13.04,30.17 11.34,31.87 | 10.55,32.66 9.93,32.72 DDR3_1.K7 | 11.12,32.1 10.78,32.44
DDR3_CKE
  Top 0.152: DDR3_1.K9 11.06,31.7 12.64,30.12 12.64,27.46 14.09,26.01 RA7.5
DDR3_DML
  Top 0.152: RA3.6 20.76,40.21 21.02,39.96 21.02,38.49 20.34,37.81 18.41,37.81 16.72,39.51 14.91,39.51 12.64,37.24 DDR3_1.E7
DDR3_DMU
  Top 0.152: RA3.5 15.05,41.01 11.8,37.75 11.34,37.75 10.95,38.15 DDR3_1.D3
DDR3_DQ0
  Top 0.14: 9.42,39.45 9.65,39.23 | 9.99,38.89 10.21,38.66
  Top 0.152: 23.76,43.13 28.24,43.13 30.98,40.39 RA1.8 | DDR3_1.E3 10.38,38.49 10.21,38.66 | 9.42,39.45 9.14,39.73 9.14,40.98 11.05,42.89 23.52,42.89 23.76,43.13 | 9.99,38.89 9.65,39.23 | 23.76,43.13
DDR3_DQ1
  Top 0.127: 12.47,34.93 12.81,34.93 13.04,34.7 13.38,34.7 13.61,34.93 13.95,34.93 14.17,34.7
  Top 0.152: 14.17,34.7 14.55,34.32 15.23,34.32 15.61,33.94 arc-45 15.62,33.92 15.62,33.04 15.78,32.88 18.1,32.88 arc-90 18.26,32.72 arc-90 18.1,32.56 15.38,32.56 arc90 15.22,32.4 arc90 15.38,32.24 18.34,32.24 19.14,33.04 19.14,33.76 19.62,34.24 RA5.7 19.92,34.21 | 12.47,34.93 12.25,34.93 DDR3_1.F7
DDR3_DQ2
  Top 0.14: 8.85,38.89 9.08,38.66
  Top 0.152: RA1.7 31.78,40.31 28.64,43.45 23.52,43.45 23.28,43.21 10.92,43.21 8.8,41.09 8.8,38.94 8.85,38.89 | 9.25,38.49 9.08,38.66 | 9.25,38.49 | 9.25,38.49 DDR3_1.F2
DDR3_DQ3
  Top 0.127: 13.04,34.36 13.38,34.36 13.61,34.13
  Top 0.152: 13.61,34.13 14.33,33.41 14.56,33.41 14.72,33.25 arc45 14.83,33.2 15.14,33.2 arc-90 15.3,33.04 arc-90 15.14,32.88 15.06,32.88 arc90 14.9,32.72 14.9,32.16 15.14,31.92 18.5,31.92 18.98,32.4 21.86,32.4 arc90 22.02,32.56 arc90 21.86,32.72 21.3,32.72 21.06,32.96 21.06,35.84 20.98,35.92 20.82,35.92 20.74,35.84 20.74,32.96 20.5,32.72 19.62,32.72 arc-90 19.46,32.88 19.46,33.12 arc-90 19.75,33.41 19.92,33.41 RA5.8 | 13.04,34.36 12.81,34.36 DDR3_1.F8
DDR3_DQ4
  Top 0.127: 7.67,37.81 7.95,37.53 | 8.52,36.96 8.29,37.19
  Top 0.152: RA1.5 33.38,40.31 29.6,44.09 23.04,44.09 22.8,43.85 10.65,43.85 6.54,39.73 6.54,38.83 7.55,37.81 7.67,37.81 | 8.69,36.79 8.52,36.96 | 8.29,37.19 7.95,37.53 | DDR3_1.H3 8.69,36.79 | 8.69,36.79
DDR3_DQ5
  Top 0.127: 12.25,33.23 12.47,33
  Top 0.152: 12.08,33.4 12.25,33.23 | 12.47,33 12.53,32.95 12.53,32.72 13.72,31.53 14.4,31.53 15.02,30.91 17.96,30.91 18.87,30 R7.2 | DDR3_1.H8 12.08,33.4 | 12.08,33.4
DDR3_DQ6
  Top 0.14: 8.29,38.32 8.52,38.09
  Top 0.152: RA1.6 32.58,40.23 29.04,43.77 23.28,43.77 23.04,43.53 10.79,43.53 7.67,40.41 7.67,38.94 8.29,38.32 | 8.69,37.92 8.52,38.09 | DDR3_1.G2 8.69,37.92 | 8.69,37.92
DDR3_DQ7
  Top 0.127: 11.68,34.13 11.91,34.36 12.25,34.36 12.47,34.13 | 12.81,33.8 13.04,33.57
  Top 0.152: 11.68,34.13 11.51,33.96 DDR3_1.H7 | 13.04,33.57 13.1,33.51 13.32,33.51 13.78,33.06 13.78,32.61 14.82,31.57 R8.2 | 12.47,34.13 12.81,33.8 | R8.2
DDR3_DQ8
  Top 0.127: 13.89,36.34 15.42,37.87
  Top 0.152: 15.42,37.87 15.59,38.04 16.38,38.04 18.02,36.4 22.66,36.4 22.74,36.32 22.74,35.84 22.82,35.76 22.98,35.76 23.06,35.84 23.06,36.56 23.14,36.64 23.3,36.64 23.38,36.56 23.38,35.68 23.46,35.6 23.62,35.6 23.7,35.68 23.7,36.64 23.78,36.72 23.94,36.72 24.25,36.41 24.25,36.07 RA4.8 | 13.89,36.34 13.65,36.34 13.37,36.62 13.37,37.13 arc90 13.21,37.29 arc90 13.05,37.13 13.05,36.39 arc90 DDR3_1.D7
DDR3_DQ9
  Top 0.14: 11.34,39.79 11.11,40.02 11.11,40.35 11.34,40.58 | 11.68,40.92 11.97,41.2
  Top 0.152: RA2.6 23.62,41.83 23.2,42.25 13.13,42.25 12.08,41.2 11.97,41.2 | 11.51,39.62 11.34,39.79 | 11.68,40.92 11.34,40.58 | 11.51,39.62 | 11.51,39.62 DDR3_1.C3
DDR3_DQ10
  Top 0.127: 14.51,35.49 14.74,35.27
  Top 0.152: 14.51,35.49 14.34,35.66 DDR3_1.C8 | 14.74,35.27 15,35.01 15.45,35.01 15.76,34.7 16.45,34.7 arc-45 16.57,34.65 16.82,34.4 16.82,33.92 16.5,33.6 16.1,33.6 arc90 15.94,33.44 arc90 16.1,33.28 16.98,33.28 arc90 17.14,33.44 17.14,34.24 arc-90 17.3,34.4 arc-90 17.46,34.24 17.46,33.44 arc90 17.62,33.28 arc90 17.78,33.44 17.78,34.88 arc-90 17.94,35.04 arc-90 18.1,34.88 18.1,33.44 arc90 18.26,33.28 arc90 18.42,33.44 18.42,34.88 18.5,34.96 18.66,34.96 18.74,34.88 18.74,34.16 18.82,34.08 18.98,34.08 19.06,34.16 19.06,34.88 19.19,35.01 19.92,35.01 RA5.6
DDR3_DQ11
  Top 0.14: 10.55,40.58 10.79,40.35 10.79,40.01
  Top 0.152: 23.9,42.63 23.84,42.57 11.19,42.57 10.21,41.6 10.21,40.92 10.55,40.58 | 23.9,42.63 | 10.79,40.01 10.79,39.78 DDR3_1.C2 | 23.9,42.63 RA2.5 | RA2.5
DDR3_DQ12
  Top 0.152: DDR3_1.A7 15.36,38.38 16.49,38.38 17.92,36.94 18.07,36.8 22.74,36.8 22.98,37.04 24.5,37.04 24.58,37.12 24.58,37.28 24.5,37.36 23.22,37.36 23.14,37.44 23.14,37.6 23.22,37.68 24.74,37.68 24.9,37.52 24.9,36.72 25.06,36.56 RA4.7
DDR3_DQ13
  Top 0.152: DDR3_1.A2 13.26,41.93 23.04,41.93 23.94,41.03 RA2.7 | RA2.7
DDR3_DQ14
  Top 0.127: 15.08,36.06 15.3,35.83
  Top 0.152: 15.08,36.06 14.91,36.23 DDR3_1.B8 | 15.3,35.83 15.47,35.66 16.98,35.66 arc45 17.09,35.71 17.38,36 17.46,36 arc-90 17.62,35.84 17.62,35.52 arc90 17.78,35.36 arc90 17.94,35.52 17.94,35.84 arc-90 18.1,36 arc-90 18.26,35.84 18.26,35.52 arc90 18.42,35.36 arc90 18.58,35.52 18.58,35.84 arc-90 18.74,36 arc-90 18.9,35.84 18.9,35.52 arc90 19.06,35.36 arc90 19.22,35.52 19.22,35.65 arc-90 19.38,35.81 19.92,35.81 RA5.5
DDR3_DQ15
  Top 0.152: RA2.8 24.26,40.23 22.88,41.61 19.04,41.61 | 19.04,41.61 14.07,41.61 DDR3_1.A3 | 19.04,41.61
DDR3_DQSL
  Top 0.152: 17.72,39.41 16.77,40.36 14.85,40.36 11.29,36.79 10.38,36.79 DDR3_1.F3 | 17.72,39.41 | 17.72,39.41 RA3.7
DDR3_DQSL#
  Top 0.152: 18.06,38.61 16.77,39.9 14.85,39.9 11.17,36.23 9.82,36.23 DDR3_1.G3 | 18.06,38.61 | 18.06,38.61 RA3.8
DDR3_DQSU
  Top 0.152: DDR3_1.C7 13.78,37.92 14.91,39.05 16.72,39.05 18.15,37.63 18.33,37.44 22.42,37.44 22.5,37.52 22.5,37.68 22.42,37.76 21.14,37.76 21.06,37.84 21.06,38 21.14,38.08 22.5,38.08 22.74,38.32 25.94,38.32 26.66,37.6 26.66,36.89 26.66,36.88 RA4.5
DDR3_DQSU#
  Top 0.152: DDR3_1.B7 14.34,38.04 15.02,38.72 16.58,38.72 18.18,37.12 22.58,37.12 22.82,37.36 22.82,37.84 22.98,38 25.06,38 25.22,37.84 25.22,37.04 25.3,36.96 25.46,36.96 25.54,37.04 25.54,37.84 25.62,37.92 25.78,37.92 25.86,37.84 25.86,37.6 26.02,37.44 26.26,37.44 26.34,37.36 26.34,37.2 26.26,37.12 26.02,37.12 25.86,36.96 RA4.6
DDR3_ODT
  Top 0.152: RA12.8 6.1,13.41 1.16,18.35 1.16,32.62 4.94,36.4 6.25,36.4 | 6.25,36.4 | 6.25,36.4 DDR3_1.K1
DDR3_RAS
  Top 0.14: 5.63,29.21 8.3,31.88
  Top 0.152: 8.3,31.88 8.3,35.48 DDR3_1.J3 | 5.63,29.21 5.63,25.53 6.62,24.55 7.06,24.55 8.08,23.53 8.08,21.12 8.99,20.21 RA9.7
DDR3_RST
  Top 0.152: RA12.6 6.26,15.01 1.9,19.37 1.9,30.57 DDR3_1.T2
DDR3_VREF  (via drill 0.3)
  Top 0.127: 10.23,30.73 9.99,30.97
  Top 0.152: 10.23,30.73 10.79,30.73 v11,30.51 | 9.82,31.14 9.99,30.97 | DDR3_1.H1 6.65,38.26 v5.97,38.26 | DDR3_1.M8 9.82,31.14 | 9.82,31.14
  Bottom 0.152: 10.95,32.55 10.95,34.08 9.87,35.15 9.87,35.72 9.24,36.35 8.67,36.35 7.14,37.88 6.35,37.88 v5.97,38.26 | 10.95,32.55 9.74,32.55 C4.1 | C4.1 C3.2 5.88,26.42 R3.1 | 10.95,32.55 10.95,30.57 v11,30.51 | R4.2 4.46,27.69 C4.1
DDR3_WE
  Top 0.14: 4.95,29.38 7.63,32.06
  Top 0.152: 7.63,32.06 7.63,34.23 7.33,34.53 | 7.33,34.53 | 7.33,34.53 DDR3_1.L3 | 4.95,29.38 4.95,25.31 6.46,23.8 RA10.5
GND  (via drill 0.3, 0.51)
  Top 0.127: 7.1,37.24 7.5,36.85 | 12.81,35.27 12.47,35.27 12.25,35.49 | 9.93,33.28 10.21,33
  Top 0.14: 6.59,34.36 6.82,34.13 | 9.99,37.75 10.21,37.53
  Top 0.152: C64.2 26.12,31.51 | C36.2 18.31,18.59 | v9.65,28.93 9.31,28.93 8.85,29.38 8.74,29.38 DDR3_1.P9 | 10.83,32.95 10.21,33 | 13.32,33.96 14.34,32.95 v14.34,32.83 | 16.72,36.79 v16.77,36.85 | v12.02,36.17 12.02,35.72 12.25,35.49 | 6.42,34.53 6.59,34.36 | v7.09,33.87 6.82,34.13 | 9.82,37.92 9.99,37.75 | 10.44,37.3 10.21,37.53 | 13.04,35.27 12.81,35.27 | v11.29,29.78 11.23,29.84 10.89,29.84 10.32,30.4 9.99,30.4 DDR3_1.M9 | 13.32,33.96 | 13.32,33.96 DDR3_1.F9 | 13.04,35.27 | 13.04,35.27 DDR3_1.E8 | S_RESET.1 48.87,1.5 v47.5,1.5 | U$15.P6 46.64,36.44 v46.6,36.4 | LIND.C 51.2,30.5 v51.3,30.4
  Top 0.203: 26.12,31.51 v25.52,32.11 | v28.08,36.05 28.08,35.31 C32.2 | v32.16,32.51 32.2,32.47 C35.2 | 18.31,18.59 v17.6,18.59 | C35.2 | L11.C L10.C 38.05,43.85 v38.1,43.9 | 19.61,4.36 18.5,3.25 18.5,2.5 17.3,1.3 15.5,1.3 14.3,2.5 14.3,11 15.3,12 17.2,12 18.3,10.9 18.3,10.45 C1.1 20.35,9.05 20.5,8.9 20.5,7.8 21.1,7.2 23.2,7.2 23.5,7.5 25.4,7.5 | 19.61,4.36 C2.1 | 19.61,4.36 21.77,4.36 | 21.77,4.36 22.54,4.36 23.1,3.8 23.7,3.8 24.1,3.4 | 21.77,4.36 21.77,4.37 v21.8,4.4 | U$1.079 23.79,12.11 v23.9,12 | CONN8.P$1 2,43.9 v2.1,44 | C33.2 22.48,30.22 22.1,29.84 v22.1,29.45
  Top 0.229: v8.29,27.8 8.06,27.8 DDR3_1.T9 | DDR3_1.T1 2.63,32.44 v2.29,32.44 | v3.48,34.08 4.05,34.08 DDR3_1.P1 | v5.12,35.72 5.12,35.27 DDR3_1.M1 | v6.48,37.3 6.59,37.41 6.93,37.41 7.1,37.24 | v9.76,33.68 9.76,33.45 9.93,33.28 | DDR3_1.B3 12.25,39.45 v12.25,39 | 10.44,37.3 10.89,37.3 v10.95,37.36 | DDR3_1.E1 DDR3_1.E2 9.82,37.92 | 9.82,40.19 9.8,40.2 | 9.8,40.2 v9.7,40.3 | 7.55,36.79 7.5,36.85 | DDR3_1.G8 DDR3_1.G9 v13.21,32.83 | DDR3_1.E8 DDR3_1.D8 | v10.83,41.43 10.95,41.32 DDR3_1.B1 | C86.2 2.3,39.92 v2.3,38.7 | DDR3_1.B9 v16.38,36.23 | DDR3_1.A9 16.72,36.79 v16.77,36.85 | DDR3_1.J8 10.83,32.95 | DDR3_1.G1 7.1,38.94 v7.1,39.05 | DDR3_1.D1 9.8,39.64 9.8,40.2 | DDR3_1.L2 6.42,34.53 | 7.55,36.79 | 7.55,36.79 DDR3_1.J2 | v13.21,32.83
  Bottom 0.152: v7.09,33.87 6.33,33.11 6.33,33.02 R2.1 | R4.1 3.05,27.69 C4.2 1.6,30.98 1.6,31.69 2.29,32.38 v2.29,32.44 | C87.2 42.88,1.88 v42.5,1.5 41.71,2.29 U$17.2 | R11.1 35.5,28.81 34.91,29.4 | 34.91,29.4 C8.2 | 34.91,29.4 34.91,30.3 v34.5,30.7 | R1.2 31.2,25.1 v30.6,25.7 | L0.C v51.3,30.4
  Bottom 0.203: C63.2 20.63,14.63 v20.3,14.3 | C82.1 21.8,7.9 v21.4,7.9 | C80.1 26.35,10.97 C81.1 v27.69,10.79 v27.7,10.8 28.45,11.55 C84.2 | C83.2 R41.1 v33.5,11.7 | C67.2 24.75,8.45 v25,8.2 | C66.2 30.8,8.5 30.5,8.2 v30,8.2 30,6.4 30.4,6 31,6 31.5,5.5 | C70.2 40.95,12.05 v39.8,13.2 | C73.2 40.3,20.2 v39.8,20.7 | C75.2 44.66,21.26 v44.7,21.3 | C74.2 44.68,22.92 v44.7,22.9 | C57.2 38.61,22.61 v38.6,22.6 | C62.2 41.83,26.13 v42.5,26.8 | C65.2 39.14,12.56 v39.8,11.9 | C61.2 37.45,28.36 v38.4,29.3 | C53.2 44.72,17.79 v44.9,17.6 | C55.2 34.34,22.94 v34.3,22.9 | C76.2 36.22,22.62 v36,22.4 | C71.2 42.1,27.6 v42.2,27.7 | C72.2 28,7.9 v28.3,8.2 | C28.2 7.18,36.6 v6.48,37.3 | CONN8.P$1 2,43.9 v2.1,44 | R36.1 40.41,30.59 v40.1,30.9 | C34.2 25.23,21.27 v25.4,21.1
  Bottom 0.229: C26.2 11.5,29.78 v11.29,29.78 | C25.2 9.65,29.51 v9.65,28.93 | C27.2 14.34,32.47 v14.34,32.83 | C24.2 14.84,36.23 v16.38,36.23 | C30.2 10.83,41.14 v10.83,41.43 | C31.2 2.29,32.22 v2.29,32.44 | v9.7,40.3 10.31,39.7 C29.2 | C51.2 40.02,10.68 v39.8,10.9 | C78.2 38.62,37.89 C79.2 38.47,36.67 v38.4,36.6
  Bottom 0.305: C85.2 34.27,10.93 v33.5,11.7
  other vias: 0.9,44 1,42.5 3.6,44.1
  pour Route2 (isolate 0.254, no thermals): -1,48 57,48 57,-1 -1,-1
L0  (via drill 0.3)
  Top 0.152: U$1.001 41.45,28.2 42.4,28.2 43.8,26.8 v47.3,26.8
  Bottom 0.152: R46.2 48.15,26.8 v47.3,26.8
L1
  Top 0.203: U$1.012 36.66,29.54 36,30.2 36,36.2 37,37.2 R31.2
L2
  Top 0.203: R32.2 35.4,37.2 35.2,37 35.2,30.2 36.26,29.14 U$1.013
LIND
  Top 0.152: R16.2 50.15,28.25 49.8,27.9 47.7,27.9 47,27.2 44,27.2 41.8,29.4 41,29.4 40.66,29.06 U$1.002
N$1  (via drill 0.3)
  Top 0.152: U$1.017 34.66,26.46 v34.5,26.3
  Bottom 0.152: v34.5,26.3 34.5,26.14 R1.1
N$2
  Top 0.152: RA1.3 32.58,36.01 33.46,35.13 U$1.020 | U$1.020
N$3
  Top 0.203: Y1.2 17.79,7.75 C1.2 20.95,6.5 22,6.5 23.5,5 24.3,5 24.66,5.36 U$1.091
N$4
  Top 0.203: Y1.1 17.89,5.75 C2.2 21.85,5.75 23.4,4.2 24.4,4.2 25.06,4.86 U$1.092
N$5
  Top 0.152: U$1.019 33.86,35.21 33.38,35.69 RA1.4
N$6  (via drill 0.3)
  Top 0.127: 8.85,32.1 9.08,31.87
  Top 0.152: v8.85,34.36 8.63,34.13 8.63,32.32 8.85,32.1 | 9.08,31.87 9.25,31.7 DDR3_1.L8
  Bottom 0.152: v8.85,34.36 7.53,33.04 7.53,31.82 R2.2
N$7
  Top 0.152: RA3.4 23,41.01 24.4,39.61 26.56,39.61 29.16,37.01 29.16,35.75 30.32,34.59 30.32,28.91 30.24,28.83 30.24,27.83 U$1.028
N$8
  Top 0.152: U$1.034 27.86,31.65 25.86,33.65 RA4.3 arc90 RA4.3
N$9
  Top 0.152: 26.66,33.33 28.26,31.73 U$1.033 | 26.66,33.33 | 26.66,33.33 RA4.4 arc90 RA4.4
N$10
  Top 0.152: U$1.027 30.66,28.81 30.64,28.83 30.64,34.75 29.48,35.91 29.48,37.17 26.99,39.66 RA2.1 | RA2.1
N$11
  Top 0.152: U$1.038 26.26,29.45 23.43,32.28 arc-45 23.38,32.39 23.38,32.48 arc-90 23.54,32.64 23.78,32.64 arc90 23.94,32.8 arc90 23.78,32.96 23.54,32.96 arc-90 23.38,33.12 arc-90 23.54,33.28 23.62,33.28 arc90 23.78,33.44 arc90 23.62,33.6 23.54,33.6 arc-90 23.38,33.76 arc-90 23.54,33.92 23.62,33.92 arc90 23.78,34.08 arc90 23.62,34.24 23.54,34.24 arc-90 23.38,34.4 arc-90 23.54,34.56 23.62,34.56 arc90 23.78,34.72 23.78,34.8 arc-90 23.94,34.96 26.5,34.96 arc90 26.66,35.12 arc90 26.5,35.28 22.82,35.28 22.26,35.84 RA5.4
N$12
  Top 0.152: 30.96,28.91 31.06,28.81 U$1.026 | RA2.2 27.79,41.03 27.94,40.88 27.94,40.46 29.8,38.6 29.8,36.07 30.96,34.91 30.96,28.91 | 30.96,28.91 | U$1.026
N$13
  Top 0.152: U$1.036 27.06,29.61 24.96,31.71 24.95,31.71 24.58,32.08 24.58,32.48 24.74,32.64 25.46,32.64 25.54,32.72 25.54,32.88 25.46,32.96 24.66,32.96 24.58,33.04 24.58,33.2 24.66,33.28 24.93,33.28 25.06,33.41 RA4.2 arc90 RA4.2
N$14  (via drill 0.3)
  Top 0.152: RA2.4 28.1,42.63 30.44,40.29 30.44,36.39 31.6,35.23 31.6,29.23 31.86,28.97 U$1.024
  Top 0.203: U$1.024 31.86,26.8 v31.46,26.4
N$15
  Top 0.152: 22.62,35.01 23.04,34.59 23.04,32.19 25.86,29.37 U$1.039 | 22.62,35.01 | 22.62,35.01 21.88,35.01 RA5.3
N$16
  Top 0.152: 30.12,36.23 31.28,35.07 31.28,29.07 31.46,28.89 U$1.025 | RA2.3 28.43,41.83 30.12,40.14 30.12,36.23 | 30.12,36.23 | U$1.025
N$17
  Top 0.152: U$1.037 26.66,29.53 24.26,31.93 RA4.1 arc90 RA4.1
N$18
  Top 0.152: RA3.3 23.16,40.21 24.08,39.29 26.4,39.29 28.84,36.85 28.84,35.59 30,34.43 30,29.07 29.86,28.93 U$1.029
N$19
  Top 0.152: 28.66,33.31 27.2,34.77 | 27.2,34.77 27.2,37.53 26.09,38.64 21.94,38.64 RA3.1 | 27.2,34.77 | 28.66,33.31 | 28.66,33.31 U$1.032
N$20
  Top 0.152: U$1.031 29.06,33.39 27.52,34.93 27.52,37.69 26.24,38.97 23.92,38.97 23.48,39.41 | 23.48,39.41 | 23.48,39.41 | 23.48,39.41 RA3.2
N$21
  Top 0.152: U$1.042 24.66,29.05 22.14,31.57 R8.1
N$22
  Top 0.152: U$1.044 23.86,28.16 23.05,28.89 21.53,28.89 20.87,29.55 R7.1
N$23
  Top 0.152: 25.06,29.13 22.4,31.79 22.4,32.97 21.93,33.44 RA5.1 | 25.06,29.13 | 25.06,29.13 U$1.041
N$24
  Top 0.152: RA1.2 31.78,36.33 33.12,34.99 33.12,28.99 | U$1.021 33.06,28.93 33.12,28.99 | 33.12,28.99
N$25
  Top 0.152: U$1.040 25.46,29.29 22.72,32.03 22.72,33.87 22.38,34.21 21.88,34.21 RA5.2
N$26
  Top 0.152: RA1.1 30.98,36.65 32.8,34.83 32.8,29.31 32.66,29.17 U$1.022 | U$1.022
N$27
  Top 0.152: U$1.063 20.56,18.51 20.08,18.03 16.96,18.03 16.8,18.19 12.48,18.19 12.24,17.95 7.72,17.95 4.86,20.81 RA10.2 | RA10.2
N$28
  Top 0.152: U$1.049 20.09,24.11 19.79,24.41 RA7.2
N$29
  Top 0.152: U$1.061 17.52,19.31 16.72,18.51 12.32,18.51 12.08,18.27 8.12,18.27 5.66,20.73 RA10.3 | RA10.3
N$30
  Top 0.152: U$1.064 20.64,18.11 20.24,17.71 16.8,17.71 16.64,17.87 12.64,17.87 12.4,17.63 7,17.63 4.06,20.57 RA10.1
N$31
  Top 0.152: U$1.052 20.71,22.91 20.4,22.6 15.8,22.6 15.5,22.9 11,22.9 10.8,23.1 RA8.3
N$32
  Top 0.152: U$1.066 20.8,17.31 20.56,17.07 18,17.07 17.44,16.51 | 17.44,16.51 | 17.44,16.51 RA11.3
N$33
  Top 0.152: RA11.4 | RA11.4 17.36,17.31 17.44,17.39 20.4,17.39 20.72,17.71 U$1.065 | U$1.065
N$34
  Top 0.152: U$1.051 20.51,23.31 20.2,23 16.2,23 16,23.2 12.2,23.2 RA8.4
N$35
  Top 0.152: U$1.067 20.88,16.91 20.72,16.75 18.24,16.75 17.2,15.71 RA11.2 | RA11.2
N$36
  Top 0.152: U$1.054 15.69,22.11 15.2,22.6 10.4,22.6 10.01,22.99 RA8.2
N$37
  Top 0.152: U$1.071 19.12,15.31 17.6,13.79 13.12,13.79 12.7,14.21 RA12.2
N$38
  Top 0.152: U$1.055 15.59,21.71 15,22.3 9.7,22.3 9.21,22.79 RA8.1
N$39
  Top 0.152: U$1.069 18.96,16.11 17.28,14.43 13.44,14.43 12.06,15.81 RA12.4
N$40
  Top 0.152: U$1.048 20.29,24.51 19.59,25.21 RA7.3
N$41
  Top 0.152: U$1.056 15.29,21.31 14.79,21.81 RA9.4
N$42
  Top 0.152: U$1.050 19.07,23.71 RA7.1
N$43
  Top 0.152: RA11.1 16.96,14.91 18.48,16.43 20.88,16.43 20.96,16.51 U$1.068 | U$1.068
N$44
  Top 0.152: U$1.057 14.41,20.91 RA9.3
N$45
  Top 0.127: U$1.045 20.84,25.71 arc-90 20.64,25.91 arc-90 20.83,26.1 23.05,26.1 arc90 23.43,26.48 23.43,26.61 arc90 23.05,26.99 14.34,26.99 arc-90 14.15,27.18 arc-90 14.34,27.37 22.8,27.37 arc90 23.18,27.75 23.18,27.88 arc90 22.8,28.26 20.26,28.26 19.37,29.15 18.61,29.15 17.64,30.11 R5.1
N$46
  Top 0.127: U$1.046 20.62,25.31 arc-90 20.32,25.61 20.32,25.98 arc-90 20.69,26.35 22.99,26.35 arc90 23.18,26.54 arc90 22.99,26.73 14.28,26.73 arc-90 13.89,27.11 13.89,27.24 arc-90 14.28,27.62 22.73,27.62 arc90 22.92,27.81 arc90 22.73,28 20.13,28 19.24,28.89 18.61,28.89 18.32,28.61 R6.1
N$47
  Top 0.152: U$1.047 20.49,24.91 19.39,26.01 RA7.4 | U$1.047
N$48
  Top 0.152: U$1.058 17.12,20.51 16.82,20.21 RA9.2
N$49
  Top 0.152: U$1.059 17.36,20.11 16.66,19.41 RA9.1
N$50
  Top 0.152: U$1.060 17.44,19.71 16.56,18.83 8.37,18.83 6.46,20.74 RA10.4
N$51
  Top 0.152: 17.44,14.11 | RA12.3 12.38,15.01 13.28,14.11 17.44,14.11 | U$1.070 19.04,15.71 17.47,14.13 17.44,14.11 | U$1.070
N$52
  Top 0.152: U$1.072 19.2,14.91 17.76,13.47 8.57,13.47 RA12.1
N$66
  Top 0.152: LIND.A R16.1
N$79
  Top 0.203: L10.A R31.1
N$84
  Top 0.203: L11.A R32.1
N$93
  Bottom 0.152: R39.2 39.45,16.1 D4.C
N$108  (via drill 0.3)
  Top 0.229: U$15.P4 46.01,38.99 v46,39
  Bottom 0.229: L9.2 40.47,41.03 40.47,39.39 45.61,39.39 v46,39
  Bottom 0.305: C79.1 40.47,39.39 C78.1
N$109
  Bottom 0.152: L0.A R46.1
NMI_N  (via drill 0.3)
  Top 0.152: v39.4,19 41.3,19 41.79,18.51 U$1.158 45.01,18.51 47,20.5 47,22 48.67,23.67 CONN14.P 49.17,23.67
  Bottom 0.152: R39.1 v39.4,19
RESET_N  (via drill 0.3)
  Top 0.152: U$1.159 41.89,18.91 41.3,19.5 38.8,19.5 37.4,18.1 37.4,9.8 39.5,7.7 44.2,7.7 | 44.2,7.7 48.61,7.7 CONN17.P | 44.2,7.7 44.2,5.08 S_RESET.4
  Top 0.203: S_RESET.4 44.16,4.33 v44.5,4
  Bottom 0.152: R34.1 41.52,5.89 U$17.1 41.82,3.89 C87.1 42.99,4 v44.5,4
SD_CD  (via drill 0.3)
  Top 0.152: U$15.G1 46.59,38.29 v46.5,38.2 | U$1.155 44.19,17.31 44.5,17 45.4,17 46.3,17.9 v46.3,18.1
  Bottom 0.152: v46.5,38.2 45.6,37.3 45.6,34.5 42.83,31.73 R36.2 42.83,28.77 45.3,26.3 45.3,19.1 v46.3,18.1
SD_CLK  (via drill 0.3)
  Top 0.152: U$1.110 32.26,7.56 32.5,7.8 32.5,8.5 27.5,13.5 27.5,15.9 27.2,16.2 27.2,25.3 v26.6,25.9 | v43.9,35.4 43.9,36.8 44.64,37.54 U$15.P5
  Bottom 0.152: RA13.1 26,24.9 26.4,25.3 26.4,25.7 v26.6,25.9 26.6,30.5 31.7,35.6 43.7,35.6 v43.9,35.4
SD_CMD  (via drill 0.3)
  Top 0.152: U$1.111 32.66,7.46 32.8,7.6 32.8,8.7 27.9,13.6 27.9,16.1 27.6,16.4 27.6,25.6 v27.3,25.9 | v43.3,35.1 43.3,38.3 44.74,39.74 U$15.P3
  Bottom 0.152: RA13.2 26.8,25.4 v27.3,25.9 27.3,30.7 31.9,35.3 43.1,35.3 v43.3,35.1
SD_D0  (via drill 0.3)
  Top 0.152: U$1.108 31.46,8.34 27.1,12.7 27.1,15.64 26.8,15.94 26.8,24.8 v25.94,25.66 | v44.5,35.7 44.86,35.34 U$15.P7
  Bottom 0.152: v25.94,25.66 25.94,27.25 | 25.94,27.25 R38.1 | 25.94,27.25 25.84,30.34 31.5,35.9 44.3,35.9 v44.5,35.7
SD_D1  (via drill 0.3)
  Top 0.152: U$1.107 31.06,8.24 26.7,12.6 26.7,15.5 26.4,15.8 26.4,23.8 v25.26,24.94 | U$15.P8 46.74,34.24 46.3,33.8 41.9,33.8 v41.5,34.2
  Bottom 0.152: R37.1 22.43,25.14 25.06,25.14 v25.26,24.94 25.26,24.04 25.7,23.6 28.8,23.6 29.4,24.2 29.4,26 29.2,26.2 29.2,31.1 32.5,34.4 41.3,34.4 v41.5,34.2
SD_D2  (via drill 0.3)
  Top 0.152: U$1.113 33.46,9.04 28.7,13.8 28.7,16.5 28.4,16.8 28.4,25.1 v28.8,25.5 | v42.1,34.5 42.1,39.2 44.84,41.94 U$15.P1
  Bottom 0.152: RA13.4 28.4,25.1 v28.8,25.5 28.8,31.2 32.3,34.7 41.9,34.7 v42.1,34.5
SD_D3  (via drill 0.3)
  Top 0.152: U$1.112 33.06,7.26 33.1,7.3 33.1,8.9 28.3,13.7 28.3,16.3 28,16.6 28,25.7 v28.2,25.9 | v42.7,34.8 42.7,38.7 44.84,40.84 U$15.P2
  Bottom 0.152: RA13.3 27.6,25.3 v28.2,25.9 28.2,31.1 32.1,35 42.5,35 v42.7,34.8
SVREF  (via drill 0.3)
  Top 0.152: U$1.018 34.26,26.86 33.7,26.3 v33.7,26.2
  Bottom 0.152: C7.2 C8.1 33.53,28.32 R11.2 33.8,26.3 v33.7,26.2 | C7.2 | C7.2 32.15,28.37 R10.1
UART1_RX
  Top 0.152: U$1.151 45.41,15.71 45.8,16.1 49.29,16.1 CONN18.P
UART1_TX
  Top 0.152: U$1.152 45.21,16.11 45.8,16.7 47.45,16.7 CONN10.P
UBOOT
  Top 0.152: U$1.157 45.11,18.11 48.13,21.13 CONN11.P
  Bottom 0.152: R40.1 47.02,21.13 CONN11.P
USBH_DM
  Top 0.152: U$1.095 26.26,4.64 26.7,4.2 26.7,3.6 26.1,3 CONN6.P
USBH_DP
  Top 0.152: U$1.096 26.66,4.64 CONN9.P
VDD_CPU  (via drill 0.3)
  Top 0.203: U$1.164 40.99,20.91 v40.9,21 | U$1.169 v40.91,22.91 v40.9,22.9 | U$1.173 41.61,24.51 v40.85,23.75 | v39.5,25.1 39.86,25.46 U$1.004 39.86,29.94 39.6,30.2 38,30.2 37.4,30.8 | U$1.016 35.06,25.76 v34.7,25.4 | U$1.156 41.19,17.71 v40.9,18 | v36.6,25.7 36.6,26.08 37.06,26.54 U$1.011 37.06,30.56 CONN2.P 37.8,30.3 37.8,30.4 37.86,30.34 U$1.009 37.86,26.34 37.5,25.98 v37.5,25.7
  Route15 0.61: v36.6,25.7 35,25.7 v34.7,25.4
  Route15 1.016: v40.9,18 v40.9,21 v40.9,22.9 40.9,23.7 v40.85,23.75 v39.5,25.1 38.9,25.7 v37.5,25.7 v36.6,25.7
  Bottom 0.203: C75.1 41.16,21.26 v40.9,21 | C74.1 40.92,22.92 v40.9,22.9 | C57.1 39.71,24.05 40.55,24.05 v40.85,23.75 | C62.1 40.33,25.93 v39.5,25.1 | C76.1 37.07,25.67 | 37.07,25.67 37.1,25.7 | C53.1 41.12,17.79 v40.9,18 | 37.07,25.67 37.04,25.7 v36.6,25.7 | 37.1,25.7 v37.5,25.7 | C55.1 35.12,24.98 v34.7,25.4 | C61.1 37.1,26.66 37.1,25.7
  pour Route15 (isolate 0.254, rank 2): 31.5,26 41.5,26 41.5,17 31.5,17
VDD_INT  (via drill 0.3)
  Top 0.203: C64.1 27.46,30.13 U$1.035 27.46,26.86 | U$1.098 27.46,8.84 v27.1,9.2 | U$1.109 31.86,8.06 v32,8.2 | v39.6,14.9 v39.61,14.91 U$1.149 46.99,14.91 47.8,14.1 47.8,13.6 | v24.9,14.6 24.81,14.51 U$1.073 | 47.8,13.6 47.8,9.9 46,8.1 40.4,8.1 v40.1,8.4 | CONN3.P 47.89,13.51 47.8,13.6
  Top 0.305: 27.46,26.86 27.22,26.62 26,26.62 24.6,25.22 24.6,23.1 v24.9,22.8
  Route15 0.61: v32,8.2 32,9.2
  Route15 1.016: v35.6,9.2 37.5,9.2 38.7,10.4 38.7,14 v39.6,14.9 38.8,14.1 | v35.6,9.2 32,9.2 | v35.6,9.2 v27.1,9.2 25.3,9.2 24.9,9.6 v24.9,14.6 24.9,15.8 25.6,16.5
  Bottom 0.203: C63.1 24.87,14.63 v24.9,14.6 | C67.1 v27.1,9.2 | C66.1 31.25,7.45 v32,8.2 | C65.1 38.63,13.93 v39.6,14.9
  Bottom 0.305: C85.1 35.31,8.91 v35.6,9.2
  pour Route15 (isolate 0.254, rank 3): 24.5,7 40.5,7 40.5,26 24.5,26
VRA1  (via drill 0.3)
  Top 0.203: U$1.083 22.79,10.51 23.1,10.2 v23.1,10
  Bottom 0.203: v23.1,10 22.72,9.62 C82.2
VRA2  (via drill 0.3)
  Top 0.203: U$1.082 22.99,10.91 23.3,10.6 v23.8,10.6
  Bottom 0.203: v23.8,10.6 23.8,10.2 24.1,9.9 27.5,9.9 27.85,10.25 C84.1 29.25,10.2 C83.1 R41.2
VRP  (via drill 0.3)
  Top 0.203: U$1.080 22.99,11.71 v23.4,11.3
  Bottom 0.203: v23.4,11.3 24.5,11.3 | 24.5,11.3 24.9,10.9 24.83,10.83 C81.2 | 24.5,11.3 25.05,11.85 C80.2

## Text on the board
tPlace: RESET | Coven A13 test m1 / 7-31-14
bPlace: 36/12 | 30/12 | 30/8 | 24/18 | 24/12 | 24/8